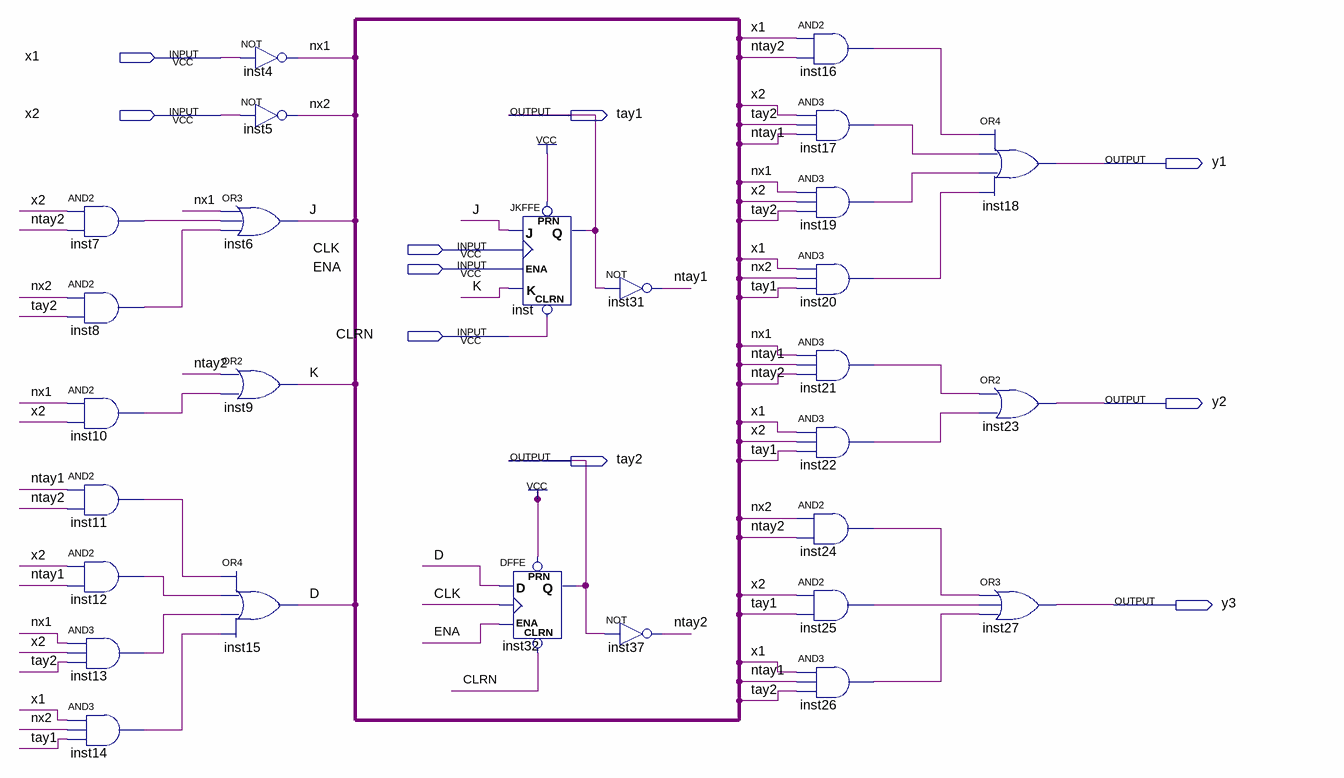
[diagram p0: schematic sheet]
// Quartus schematic mealy.bdf as structural Verilog: 28 symbols, 10 pins
module mealy (
  input  x1,
  input  x2,
  input  CLK,
  input  ENA,
  input  CLRN,
  output tay1,
  output y1,
  output y2,
  output tay2,
  output y3
);

  wire D, inst7_out, inst8_out, inst10_out, inst11_out, inst12_out, inst13_out, inst14_out, inst16_out,
       inst17_out, inst19_out, inst20_out, inst21_out, inst22_out, inst24_out, inst25_out, inst26_out, J, K,
       ntay1, ntay2, nx1, nx2;

  and inst7 (inst7_out, x2, ntay2);
  and inst8 (inst8_out, nx2, tay2);
  and inst10 (inst10_out, nx1, x2);
  and inst11 (inst11_out, ntay1, ntay2);
  and inst12 (inst12_out, x2, ntay1);
  and inst13 (inst13_out, nx1, x2, tay2);
  and inst14 (inst14_out, x1, nx2, tay1);
  not inst4 (nx1, x1);
  not inst5 (nx2, x2);
  or inst6 (J, nx1, inst7_out, inst8_out);
  or inst9 (K, ntay2, inst10_out);
  or inst15 (D, inst11_out, inst12_out, inst13_out, inst14_out);
  DFFE inst32 (.PRN(1'b1), .CLRN(CLRN), .D(D), .CLK(CLK), .ENA(ENA), .Q(tay2));
  JKFFE inst (.PRN(1'b1), .J(J), .CLK(CLK), .CLRN(CLRN), .K(K), .ENA(ENA), .Q(tay1));
  not inst31 (ntay1, tay1);
  not inst37 (ntay2, tay2);
  and inst16 (inst16_out, x1, ntay2);
  and inst17 (inst17_out, x2, tay2, ntay1);
  and inst19 (inst19_out, nx1, x2, tay2);
  and inst20 (inst20_out, x1, nx2, tay1);
  and inst21 (inst21_out, nx1, ntay1, ntay2);
  and inst22 (inst22_out, x1, x2, tay1);
  and inst24 (inst24_out, nx2, ntay2);
  and inst25 (inst25_out, x2, tay1);
  and inst26 (inst26_out, x1, ntay1, tay2);
  or inst18 (y1, inst16_out, inst17_out, inst19_out, inst20_out);
  or inst23 (y2, inst21_out, inst22_out);
  or inst27 (y3, inst24_out, inst25_out, inst26_out);
endmodule
